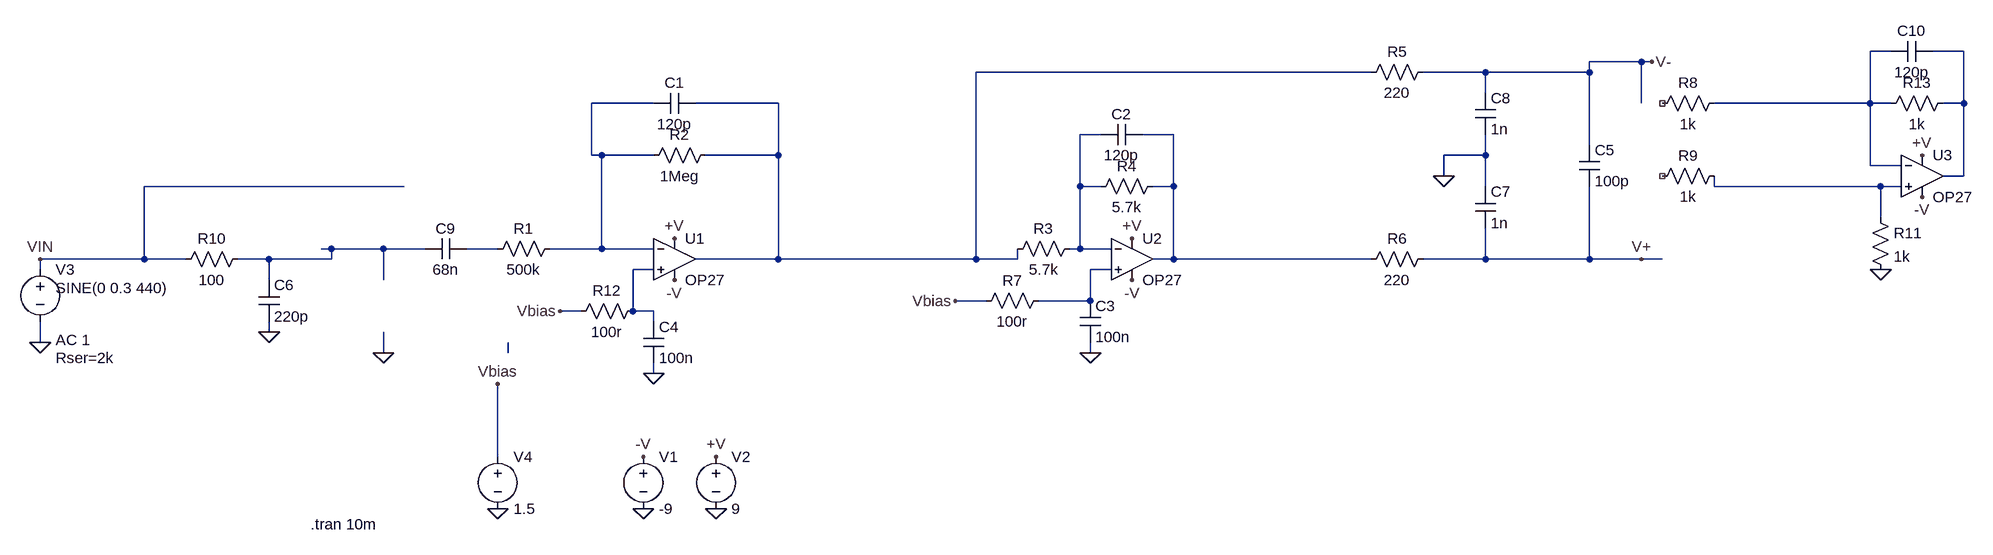
[diagram p0: schematic AD1939_input_with_offset.asc]
AD1939_input_with_offset.asc, the LTspice schematic file:
Version 4
SHEET 1 2560 920
WIRE 2432 176 2400 176
WIRE 2544 176 2496 176
WIRE 2048 192 1968 192
WIRE 2064 192 2048 192
WIRE 1632 208 1024 208
WIRE 1808 208 1712 208
WIRE 1968 208 1968 192
WIRE 1968 208 1808 208
WIRE 1808 240 1808 208
WIRE 528 256 432 256
WIRE 720 256 592 256
WIRE 2048 256 2048 192
WIRE 2400 256 2400 176
WIRE 2400 256 2160 256
WIRE 2432 256 2400 256
WIRE 2544 256 2544 176
WIRE 2544 256 2512 256
WIRE 1216 304 1184 304
WIRE 1328 304 1280 304
WIRE 1968 320 1968 208
WIRE 432 336 432 256
WIRE 448 336 432 336
WIRE 528 336 448 336
WIRE 720 336 720 256
WIRE 720 336 608 336
WIRE 1808 336 1808 304
WIRE 1808 336 1744 336
WIRE 2400 352 2400 256
WIRE 2448 352 2400 352
WIRE 1744 368 1744 336
WIRE 2544 368 2544 256
WIRE 2544 368 2512 368
WIRE 144 384 -256 384
WIRE 1184 384 1184 304
WIRE 1216 384 1184 384
WIRE 1328 384 1328 304
WIRE 1328 384 1296 384
WIRE 1808 384 1808 336
WIRE 2160 384 2160 368
WIRE 2416 384 2160 384
WIRE 2448 384 2416 384
WIRE 2416 432 2416 384
WIRE 32 480 16 480
WIRE 112 480 32 480
WIRE 176 480 112 480
WIRE 288 480 240 480
WIRE 448 480 448 336
WIRE 448 480 368 480
WIRE 528 480 448 480
WIRE 1184 480 1184 384
WIRE 1184 480 1168 480
WIRE 1232 480 1184 480
WIRE -256 496 -256 384
WIRE -256 496 -416 496
WIRE -192 496 -256 496
WIRE -64 496 -112 496
WIRE 32 496 32 480
WIRE 32 496 -64 496
WIRE 720 496 720 336
WIRE 720 496 592 496
WIRE 1024 496 1024 208
WIRE 1024 496 720 496
WIRE 1088 496 1088 480
WIRE 1088 496 1024 496
WIRE 1328 496 1328 384
WIRE 1328 496 1296 496
WIRE 1632 496 1328 496
WIRE 1808 496 1808 448
WIRE 1808 496 1712 496
WIRE 1968 496 1968 384
WIRE 1968 496 1808 496
WIRE 2048 496 1968 496
WIRE 2080 496 2048 496
WIRE -416 512 -416 496
WIRE 528 512 496 512
WIRE 1232 512 1200 512
WIRE -64 528 -64 496
WIRE 112 528 112 480
WIRE 1040 560 992 560
WIRE 1200 560 1200 512
WIRE 1200 560 1120 560
WIRE 416 576 384 576
WIRE 496 576 496 512
WIRE 528 576 496 576
WIRE 528 592 528 576
WIRE -64 608 -64 592
WIRE -416 624 -416 592
WIRE 112 640 112 608
WIRE 304 640 304 624
WIRE 1200 640 1200 624
WIRE 528 672 528 656
WIRE 288 800 288 688
FLAG 512 880 0
FLAG 624 880 0
FLAG -416 624 0
FLAG 512 800 -V
FLAG 624 800 +V
FLAG 560 528 -V
FLAG 560 464 +V
FLAG 1264 464 +V
FLAG 1264 528 -V
FLAG 1744 368 0
FLAG -64 608 0
FLAG 288 880 0
FLAG 992 560 Vbias
FLAG 384 576 Vbias
FLAG 112 640 0
FLAG 288 688 Vbias
FLAG 1200 640 0
FLAG 528 672 0
FLAG -416 496 VIN
FLAG 2064 192 V-
FLAG 2048 496 V+
FLAG 2480 336 +V
FLAG 2480 400 -V
FLAG 2416 512 0
SYMBOL voltage 512 784 R0
WINDOW 123 0 0 Left 0
WINDOW 39 0 0 Left 0
SYMATTR InstName V1
SYMATTR Value -9
SYMBOL voltage 624 784 R0
WINDOW 123 0 0 Left 0
WINDOW 39 0 0 Left 0
SYMATTR InstName V2
SYMATTR Value 9
SYMBOL res 624 320 R90
WINDOW 0 0 56 VBottom 2
WINDOW 3 32 56 VTop 2
SYMATTR InstName R2
SYMATTR Value 1Meg
SYMBOL cap 592 240 R90
WINDOW 0 0 32 VBottom 2
WINDOW 3 32 32 VTop 2
SYMATTR InstName C1
SYMATTR Value 120p
SYMBOL voltage -416 496 R0
WINDOW 123 24 124 Left 2
WINDOW 39 24 152 Left 2
WINDOW 3 24 44 Left 2
SYMATTR Value2 AC 1
SYMATTR SpiceLine Rser=2k
SYMATTR Value SINE(0 0.3 440)
SYMATTR InstName V3
SYMBOL res 1184 464 R90
WINDOW 0 0 56 VBottom 2
WINDOW 3 32 56 VTop 2
SYMATTR InstName R3
SYMATTR Value 5.7k
SYMBOL res 1312 368 R90
WINDOW 0 0 56 VBottom 2
WINDOW 3 32 56 VTop 2
SYMATTR InstName R4
SYMATTR Value 5.7k
SYMBOL cap 1280 288 R90
WINDOW 0 0 32 VBottom 2
WINDOW 3 32 32 VTop 2
SYMATTR InstName C2
SYMATTR Value 120p
SYMBOL res 1728 192 R90
WINDOW 0 0 56 VBottom 2
WINDOW 3 32 56 VTop 2
SYMATTR InstName R5
SYMATTR Value 220
SYMBOL res 1728 480 R90
WINDOW 0 0 56 VBottom 2
WINDOW 3 32 56 VTop 2
SYMATTR InstName R6
SYMATTR Value 220
SYMBOL cap 1952 320 R0
SYMATTR InstName C5
SYMATTR Value 100p
SYMBOL OpAmps\\OP27 560 432 R0
SYMATTR InstName U1
SYMBOL OpAmps\\OP27 1264 432 R0
SYMATTR InstName U2
SYMBOL cap 1792 384 R0
SYMATTR InstName C7
SYMATTR Value 1n
SYMBOL cap 1792 240 R0
SYMATTR InstName C8
SYMATTR Value 1n
SYMBOL cap 176 496 R270
WINDOW 0 32 32 VTop 2
WINDOW 3 0 32 VBottom 2
SYMATTR InstName C9
SYMATTR Value 68n
SYMBOL cap -80 528 R0
SYMATTR InstName C6
SYMATTR Value 220p
SYMBOL res -96 480 R90
WINDOW 0 0 56 VBottom 2
WINDOW 3 32 56 VTop 2
SYMATTR InstName R10
SYMATTR Value 100
SYMBOL voltage 288 784 R0
WINDOW 123 0 0 Left 0
WINDOW 39 0 0 Left 0
SYMATTR InstName V4
SYMATTR Value 1.5
SYMBOL cap 1184 560 R0
SYMATTR InstName C3
SYMATTR Value 100n
SYMBOL res 400 592 R270
WINDOW 0 32 56 VTop 2
WINDOW 3 0 56 VBottom 2
SYMATTR InstName R12
SYMATTR Value 100r
SYMBOL res 384 464 R90
WINDOW 0 0 56 VBottom 2
WINDOW 3 32 56 VTop 2
SYMATTR InstName R1
SYMATTR Value 500k
SYMBOL cap 512 592 R0
SYMATTR InstName C4
SYMATTR Value 100n
SYMBOL res 1024 576 R270
WINDOW 0 32 56 VTop 2
WINDOW 3 0 56 VBottom 2
SYMATTR InstName R7
SYMATTR Value 100r
SYMBOL res 2176 240 R90
WINDOW 0 0 56 VBottom 2
WINDOW 3 32 56 VTop 2
SYMATTR InstName R8
SYMATTR Value 1k
SYMBOL res 2176 352 R90
WINDOW 0 0 56 VBottom 2
WINDOW 3 32 56 VTop 2
SYMATTR InstName R9
SYMATTR Value 1k
SYMBOL res 2528 240 R90
WINDOW 0 0 56 VBottom 2
WINDOW 3 32 56 VTop 2
SYMATTR InstName R13
SYMATTR Value 1k
SYMBOL cap 2496 160 R90
WINDOW 0 0 32 VBottom 2
WINDOW 3 32 32 VTop 2
SYMATTR InstName C10
SYMATTR Value 120p
SYMBOL OpAmps\\OP27 2480 304 R0
SYMATTR InstName U3
SYMBOL res 2400 416 R0
SYMATTR InstName R11
SYMATTR Value 1k
TEXT 0 904 Left 2 !.tran 10m

The netlist it stands for:
* AD1939_input_with_offset.asc
V1 -V 0 -9
V2 +V 0 9
R2 N003 N004 1Meg
C1 N003 N004 120p
V3 VIN 0 SINE(0 0.3 440) AC 1 Rser=2k
R3 N005 N003 5.7k
R4 N006 N005 5.7k
C2 N006 N005 120p
R5 V- N003 220
R6 V+ N006 220
C5 V- V+ 100p
XU1 N010 N004 +V -V N003 OP27  ; pins In+ In- V+ V- OUT
XU2 N011 N005 +V -V N006 OP27  ; pins In+ In- V+ V- OUT
C7 0 V+ 1n
C8 V- 0 1n
C9 N008 N009 68n
C6 N008 0 220p
R10 N008 VIN 100
V4 Vbias 0 1.5
C3 N011 0 100n
R12 Vbias N010 100r
R1 N004 N009 500k
C4 N010 0 100n
R7 Vbias N011 100r
R8 N001 NC_01 1k
R9 N007 NC_02 1k
R13 N002 N001 1k
C10 N002 N001 120p
XU3 N007 N001 +V -V N002 OP27  ; pins In+ In- V+ V- OUT
R11 N007 0 1k
.tran 10m
.lib ADI.lib
.backanno
.end